# EAGLE design carteProtoV2 (EAGLE 6.1)
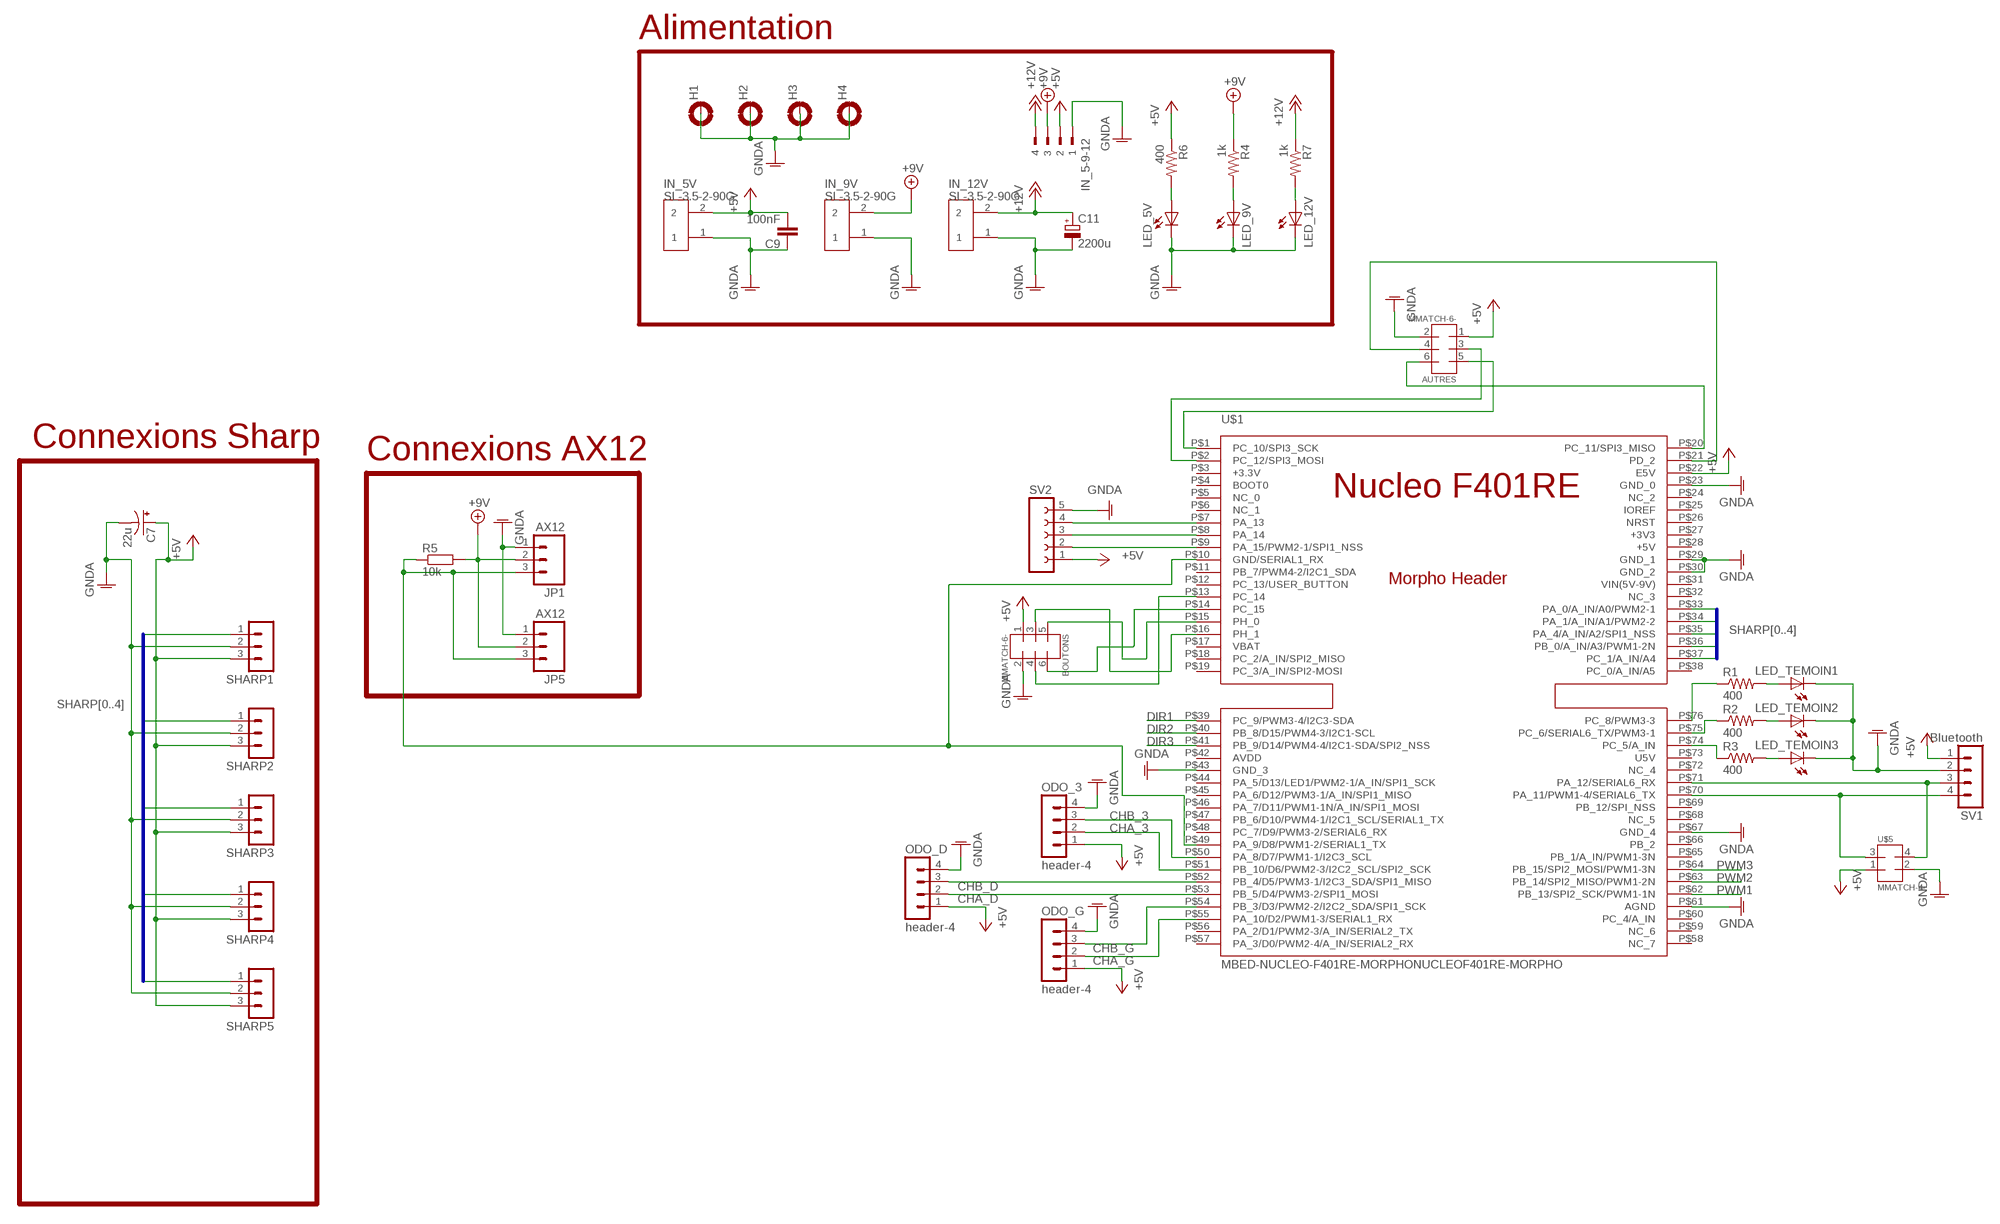
[diagram p0: schematic, sheet 1, part 1 of 2]
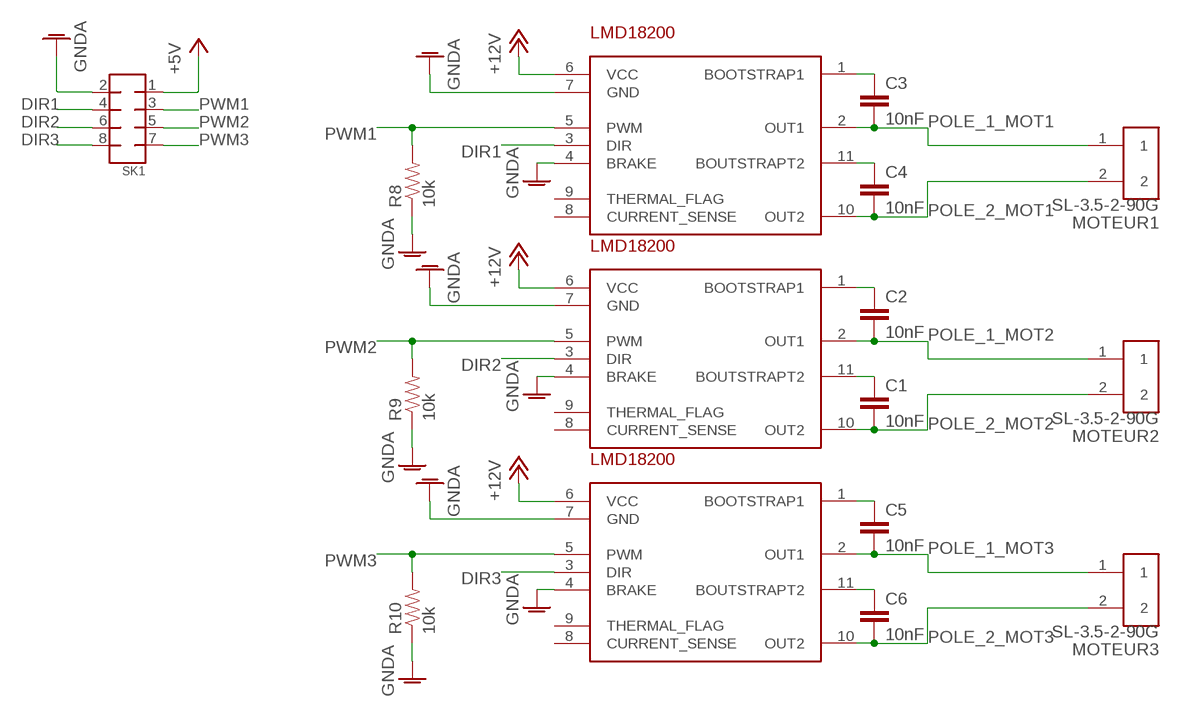
[diagram p1: schematic, sheet 1, part 2 of 2]

## Parts
AUTRES  MMATCH-6-  [AMP-215079-6]
BOUTONS  MMATCH-6-  [AMP-215079-6]
C1  10nF  C-EUC0805  [C0805]
C2  10nF  C-EUC0805  [C0805]
C3  10nF  C-EUC0805  [C0805]
C4  10nF  C-EUC0805  [C0805]
C5  10nF  C-EUC0805  [C0805]
C6  10nF  C-EUC0805  [C0805]
C7  22u  CAP_POLPTH1  [CPOL-RADIAL-100UF-25V]
C9  100nF  C-EUC0805  [C0805]
C11  2200u  CPOL-EUTT5D11  [TT5D11]
H1  MOUNT-PAD-ROUND3.2  [3,2-PAD]
H2  MOUNT-PAD-ROUND3.2  [3,2-PAD]
H3  MOUNT-PAD-ROUND3.2  [3,2-PAD]
H4  MOUNT-PAD-ROUND3.2  [3,2-PAD]
IN_5-9-12  90G-4  [90G-4]
IN_5V  SL-3.5-2-90G  [SL-3.5-2-90G]
IN_9V  SL-3.5-2-90G  [SL-3.5-2-90G]
IN_12V  SL-3.5-2-90G  [SL-3.5-2-90G]
JP1  AX12  M03POLAR  [MOLEX-1X3]
JP5  AX12  M03POLAR  [MOLEX-1X3]
LED_5V  LEDCHIPLED_0805  [CHIPLED_0805]
LED_9V  LEDCHIPLED_0805  [CHIPLED_0805]
LED_12V  LEDCHIPLED_0805  [CHIPLED_0805]
LED_TEMOIN1  LEDCHIPLED_0805  [CHIPLED_0805]
LED_TEMOIN2  LEDCHIPLED_0805  [CHIPLED_0805]
LED_TEMOIN3  LEDCHIPLED_0805  [CHIPLED_0805]
MOTEUR1  SL-3.5-2-90G  [SL-3.5-2-90G]
MOTEUR2  SL-3.5-2-90G  [SL-3.5-2-90G]
MOTEUR3  SL-3.5-2-90G  [SL-3.5-2-90G]
ODO_3  header-4  MA04-1  [MA04-1]
ODO_D  header-4  MA04-1  [MA04-1]
ODO_G  header-4  MA04-1  [MA04-1]
R1  400  RESISTOR0805-RES  [0805]
R2  400  RESISTOR0805-RES  [0805]
R3  400  RESISTOR0805-RES  [0805]
R4  1k  RESISTOR0805-RES  [0805]
R5  10k  R-EU_M0805  [M0805]
R6  400  RESISTOR0805-RES  [0805]
R7  1k  RESISTOR0805-RES  [0805]
R8  10k  RESISTOR0805-RES  [0805]
R9  10k  RESISTOR0805-RES  [0805]
R10  10k  RESISTOR0805-RES  [0805]
SHARP1  MA03-1  [MA03-1]
SHARP2  MA03-1  [MA03-1]
SHARP3  MA03-1  [MA03-1]
SHARP4  MA03-1  [MA03-1]
SHARP5  MA03-1  [MA03-1]
SK1  MMATCH-8-PTH  [AMP-215079-8]
SV1  Bluetooth  MA04-1  [MA04-1]
SV2  FE05-1  [FE05-1]
U$1  MBED-NUCLEO-F401RE-MORPHONUCLEOF401RE-MORPHO  [MORPHO-HEADERS]
U$2  LMD18200  [LMD18200]
U$3  LMD18200  [LMD18200]
U$4  LMD18200  [LMD18200]
U$5  MMATCH-4-  [AMP-215079-4]

## Nets
+5V: AUTRES.1 BOUTONS.1 C7.1(+) C9.2 IN_5-9-12.2 IN_5V.2 ODO_3.1 ODO_D.1 ODO_G.1 R6.1 SHARP1.3 SHARP2.3 SHARP3.3 SHARP4.3 SHARP5.3 SK1.1 SV1.1 SV2.1 U$1.P$22(E5V) U$5.1
+9V: IN_5-9-12.3 IN_9V.2 JP1.2 JP5.2 R4.1 R5.2
+12V: C11.+ IN_5-9-12.4 IN_12V.2 R7.1 U$2.6(VCC) U$3.6(VCC) U$4.6(VCC)
CHA_3: ODO_3.2 U$1.P$51(PB_10/D6/PWM2-3/I2C2_SCL/SPI2_SCK)
CHA_D: ODO_D.2 U$1.P$53(PB_5/D4/PWM3-2/SPI1_MOSI)
CHA_G: ODO_G.2 U$1.P$55(PA_10/D2/PWM1-3/SERIAL1_RX)
CHB_3: ODO_3.3 U$1.P$50(PA_8/D7/PWM1-1/I2C3_SCL)
CHB_D: ODO_D.3 U$1.P$52(PB_4/D5/PWM3-1/I2C3_SDA/SPI1_MISO)
CHB_G: ODO_G.3 U$1.P$54(PB_3/D3/PWM2-2/I2C2_SDA/SPI1_SCK)
DIR1: SK1.4 U$1.P$39(PC_9/PWM3-4/I2C3-SDA) U$2.3(DIR)
DIR2: SK1.6 U$1.P$40(PB_8/D15/PWM4-3/I2C1-SCL) U$3.3(DIR)
DIR3: SK1.8 U$1.P$41(PB_9/D14/PWM4-4/I2C1-SDA/SPI2_NSS) U$4.3(DIR)
GNDA: AUTRES.2 BOUTONS.2 C7.2(-) C9.1 C11.- H1.B3,2(MOUNT) H2.B3,2(MOUNT) H3.B3,2(MOUNT) H4.B3,2(MOUNT) IN_5-9-12.1 IN_5V.1 IN_9V.1 IN_12V.1 JP1.1 JP5.1 LED_5V.C LED_9V.C LED_12V.C LED_TEMOIN1.C LED_TEMOIN2.C LED_TEMOIN3.C ODO_3.4 ODO_D.4 ODO_G.4 R8.1 R9.1 R10.1 SHARP1.2 SHARP2.2 SHARP3.2 SHARP4.2 SHARP5.2 SK1.2 SV1.2 SV2.5 U$1.P$23(GND_0) U$1.P$29(GND_1) U$1.P$30(GND_2) U$1.P$43(GND_3) U$1.P$61(AGND) U$1.P$67(GND_4) U$2.4(BRAKE) U$2.7(GND) U$3.4(BRAKE) U$3.7(GND) U$4.4(BRAKE) U$4.7(GND) U$5.2
N$1: C1.1 U$3.11(BOUTSTRAPT2)
N$2: C5.1 U$4.1(BOOTSTRAP1)
N$3: C2.1 U$3.1(BOOTSTRAP1)
N$4: C6.1 U$4.11(BOUTSTRAPT2)
N$5: C3.1 U$2.1(BOOTSTRAP1)
N$6: SV1.3 U$1.P$71(PA_12/SERIAL6_RX) U$5.4
N$7: C4.1 U$2.11(BOUTSTRAPT2)
N$8: SV1.4 U$1.P$70(PA_11/PWM1-4/SERIAL6_TX) U$5.3
N$9: LED_5V.A R6.2
N$10: LED_TEMOIN3.A R3.2
N$11: LED_12V.A R7.2
N$12: R1.1 U$1.P$76(PC_8/PWM3-3)
N$13: R2.1 U$1.P$75(PC_6/SERIAL6_TX/PWM3-1)
N$14: R3.1 U$1.P$74(PC_5/A_IN)
N$15: LED_TEMOIN1.A R1.2
N$16: LED_TEMOIN2.A R2.2
N$17: BOUTONS.3 U$1.P$16(PH_1)
N$18: BOUTONS.5 U$1.P$15(PH_0)
N$19: BOUTONS.6 U$1.P$14(PC_15)
N$20: BOUTONS.4 U$1.P$13(PC_14)
N$21: SV2.4 U$1.P$7(PA_13)
N$22: SV2.3 U$1.P$8(PA_14)
N$23: SV2.2 U$1.P$9(PA_15/PWM2-1/SPI1_NSS)
N$24: AUTRES.3 U$1.P$2(PC_12/SPI3_MOSI)
N$25: LED_9V.A R4.2
N$26: AUTRES.5 U$1.P$1(PC_10/SPI3_SCK)
N$27: AUTRES.4 U$1.P$21(PD_2)
N$28: AUTRES.6 U$1.P$20(PC_11/SPI3_MISO)
POLE_1_MOT1: C3.2 MOTEUR1.1 U$2.2(OUT1)
POLE_1_MOT2: C2.2 MOTEUR2.1 U$3.2(OUT1)
POLE_1_MOT3: C5.2 MOTEUR3.1 U$4.2(OUT1)
POLE_2_MOT1: C4.2 MOTEUR1.2 U$2.10(OUT2)
POLE_2_MOT2: C1.2 MOTEUR2.2 U$3.10(OUT2)
POLE_2_MOT3: C6.2 MOTEUR3.2 U$4.10(OUT2)
PWM1: R8.2 SK1.3 U$1.P$62(PB_13/SPI2_SCK/PWM1-1N) U$2.5(PWM)
PWM2: R9.2 SK1.5 U$1.P$63(PB_14/SPI2_MISO/PWM1-2N) U$3.5(PWM)
PWM3: R10.2 SK1.7 U$1.P$64(PB_15/SPI2_MOSI/PWM1-3N) U$4.5(PWM)
SERIAL1: JP1.3 JP5.3 R5.1 U$1.P$10(GND/SERIAL1_RX) U$1.P$49(PA_9/D8/PWM1-2/SERIAL1_TX)
SHARP0: SHARP1.1 U$1.P$33(PA_0/A_IN/A0/PWM2-1)
SHARP1: SHARP2.1 U$1.P$34(PA_1/A_IN/A1/PWM2-2)
SHARP2: SHARP3.1 U$1.P$35(PA_4/A_IN/A2/SPI1_NSS)
SHARP3: SHARP4.1 U$1.P$36(PB_0/A_IN/A3/PWM1-2N)
SHARP4: SHARP5.1 U$1.P$37(PC_1/A_IN/A4)
Unconnected: U$1.P$3(+3.3V) U$1.P$4(BOOT0) U$1.P$5(NC_0) U$1.P$6(NC_1) U$1.P$11(PB_7/PWM4-2/I2C1_SDA) U$1.P$12(PC_13/USER_BUTTON) U$1.P$17(VBAT) U$1.P$18(PC_2/A_IN/SPI2_MISO) U$1.P$19(PC_3/A_IN/SPI2-MOSI) U$1.P$24(NC_2) U$1.P$25(IOREF) U$1.P$26(NRST) U$1.P$27(+3V3) U$1.P$28(+5V) U$1.P$31(VIN(5V-9V)) U$1.P$32(NC_3) U$1.P$38(PC_0/A_IN/A5) U$1.P$42(AVDD) U$1.P$44(PA_5/D13/LED1/PWM2-1/A_IN/SPI1_SCK) U$1.P$45(PA_6/D12/PWM3-1/A_IN/SPI1_MISO) U$1.P$46(PA_7/D11/PWM1-1N/A_IN/SPI1_MOSI) U$1.P$47(PB_6/D10/PWM4-1/I2C1_SCL/SERIAL1_TX) U$1.P$48(PC_7/D9/PWM3-2/SERIAL6_RX) U$1.P$56(PA_2/D1/PWM2-3/A_IN/SERIAL2_TX) U$1.P$57(PA_3/D0/PWM2-4/A_IN/SERIAL2_RX) U$1.P$58(NC_7) U$1.P$59(NC_6) U$1.P$60(PC_4/A_IN) U$1.P$65(PB_1/A_IN/PWM1-3N) U$1.P$66(PB_2) U$1.P$68(NC_5) U$1.P$69(PB_12/SPI_NSS) U$1.P$72(NC_4) U$1.P$73(U5V) U$2.8(CURRENT_SENSE) U$2.9(THERMAL_FLAG) U$3.8(CURRENT_SENSE) U$3.9(THERMAL_FLAG) U$4.8(CURRENT_SENSE) U$4.9(THERMAL_FLAG)

## Buses
SHARP[0..4]

## Notes on the sheet
- Alimentation
- Connexions Sharp
- Connexions AX12

## Library data of the parts
AUTRES BOUTONS = jt-con-micromatch:MMATCH-6-*
C1-C6 C9 = rcl:C-EU: CAPACITOR, European symbol
C7 = SparkFun-Capacitors:CAP_POL: Capacitor Polarized These are standard SMD and PTH capacitors. Normally 10uF, 47uF, and 100uF in electrolytic and tantalum varieties. Always verify the external diameter of the through hole cap, it varies with capacity, voltage, and manufacturer. The EIA devices should be standard.
C11 = rcl:CPOL-EU: POLARIZED CAPACITOR, European symbol
H1-H4 = holes:MOUNT-PAD-ROUND: MOUNTING PAD, round
IN_5-9-12 = con-weidmueller-sl35:90G-4: WEIDMUELLER CLAMP CONNECTOR; OC_FARNELL: unknown; OC_NEWARK: unknown
IN_5V IN_9V IN_12V MOTEUR1-MOTEUR3 = WEIDMULLER:SL-3.5-2-90G
JP1 JP5 = SparkFun-Connectors:M03: Header 3 Standard 3-pin 0.1" header. Use with straight break away headers (SKU : PRT-00116), right angle break away headers (PRT-00553), swiss pins (PRT-00743), machine pins (PRT-00117), and female headers (PRT-00115). Molex polarized connector foot print use with SKU : PRT-08232 with associated crimp pins and housings.
LED_5V LED_9V LED_12V LED_TEMOIN1-LED_TEMOIN3 = adafruit:LED: LED OSRAM: - CHIPLED LG R971, LG N971, LY N971, LG Q971, LY Q971, LO R971, LY R971 LH N974, LH R974 LS Q976, LO Q976, LY Q976 LO Q996 - Hyper CHIPLED LW Q18S LB Q993, LB Q99A, LB R99A - SideLED LS A670, LO A670, LY A670, LG A670, LP A670 LB A673, LV A673, LT A673, LW A673 LH A674 LY A675 LS A676, LA A676, LO A676, LY A676, LW A676 LS A679, LY A679, LG A679 - Hyper Micro SIDELED® LS Y876, LA Y876, LO Y876, LY Y876 LT Y87S - SmartLED LW L88C, LW L88S LB L89C, LB L89S, LG L890 LS L89K, LO L89K, LY L89K LS L896, LA L896, LO L896, LY L896 - TOPLED LS T670, LO T670, LY T670, LG T670, LP T670 LSG T670, LSP T670, LSY T670, LOP T670, LYG T670 LG T671, LOG T671, LSG T671 LB T673, LV T673, LT T673, LW T673 LH T674 LS T676, LA T676, LO T676, LY T676, LB T676, LH T676, LSB T676, LW T676 LB T67C, LV T67C, LT T67C, LS T67K, LO T67K, LY T67K, LW E67C LS E67B, LA E67B, LO E67B, LY E67B, LB E67C, LV E67C, LT E67C LW T67C LS T679, LY T679, LG T679 LS T770, LO T770, LY T770, LG T770, LP T770 LB T773, LV T773, LT T773, LW T773 LH T774 LS E675, LA E675, LY E675, LS T675 LS T776, LA T776, LO T776, LY T776, LB T776 LHGB T686 LT T68C, LB T68C - Hyper Mini TOPLED® LB M676 - Mini TOPLED Santana® LG M470 LS M47K, LO M47K, LY M47K Source: http://www.osram.convergy.de/
ODO_3 ODO_D ODO_G SV1 = con-lstb:MA04-1: PIN HEADER; OC_FARNELL: unknown; OC_NEWARK: unknown
R1-R4 R6-R10 = SparkFun-Passives:RESISTOR: Resistor Basic schematic elements and footprints for 0603, 1206, and PTH resistors.; OC_FARNELL: unknown
R5 = rcl:R-EU_: RESISTOR, European symbol
SHARP1-SHARP5 = con-lstb:MA03-1: PIN HEADER; OC_FARNELL: unknown; OC_NEWARK: unknown
SK1 = jt-con-micromatch:MMATCH-8-*: AMP Micromatch 8-pin
SV2 = con-lsta:FE05-1: FEMALE HEADER; OC_FARNELL: unknown; OC_NEWARK: unknown
U$1 = mbed-nucleo:MBED-NUCLEO-F401RE-MORPHO
U$2-U$4 = texas:LMD18200
U$5 = jt-con-micromatch:MMATCH-4-*

## Board
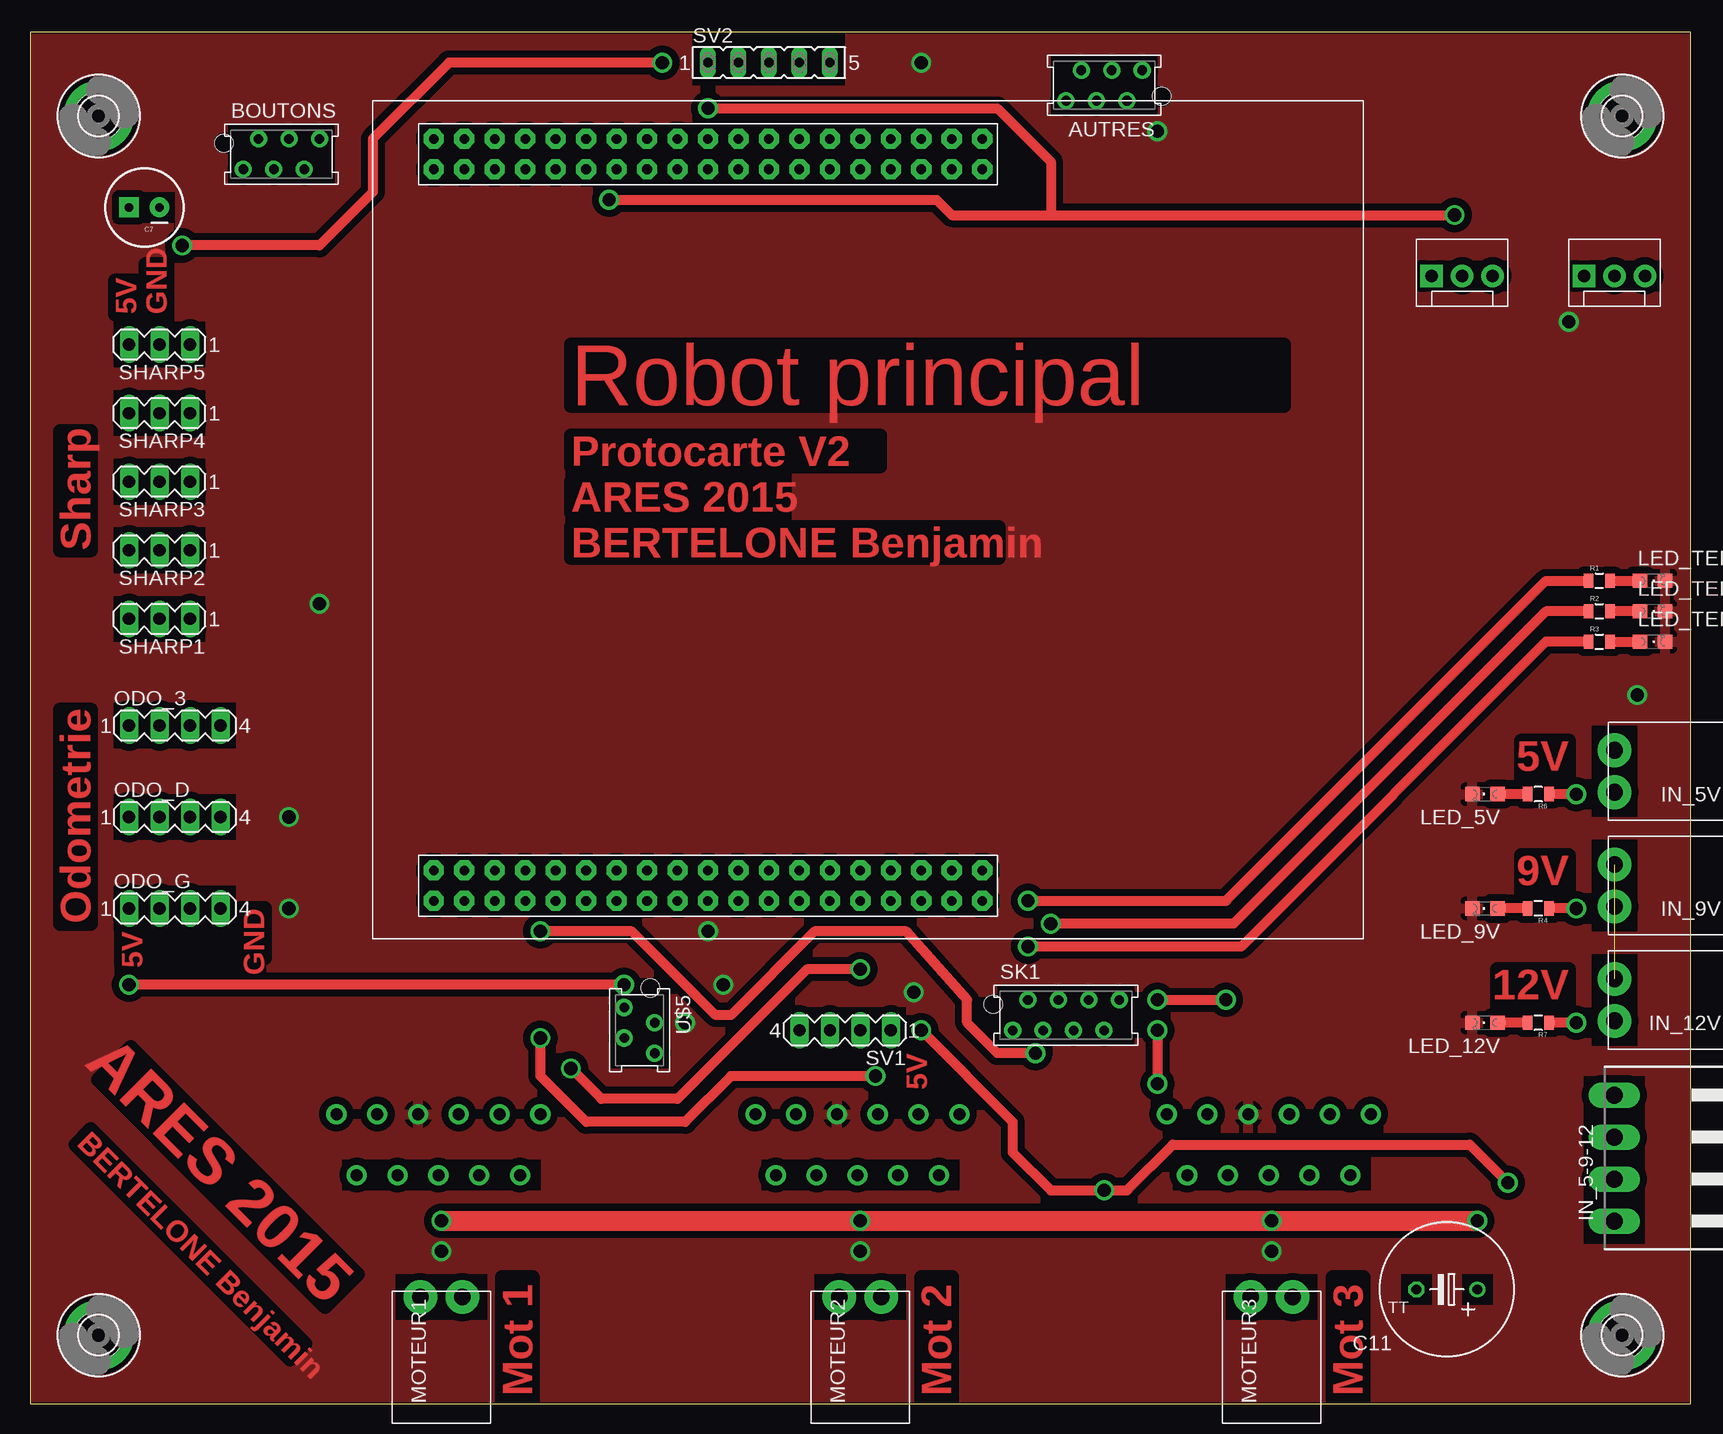
[diagram p2: board, top side]
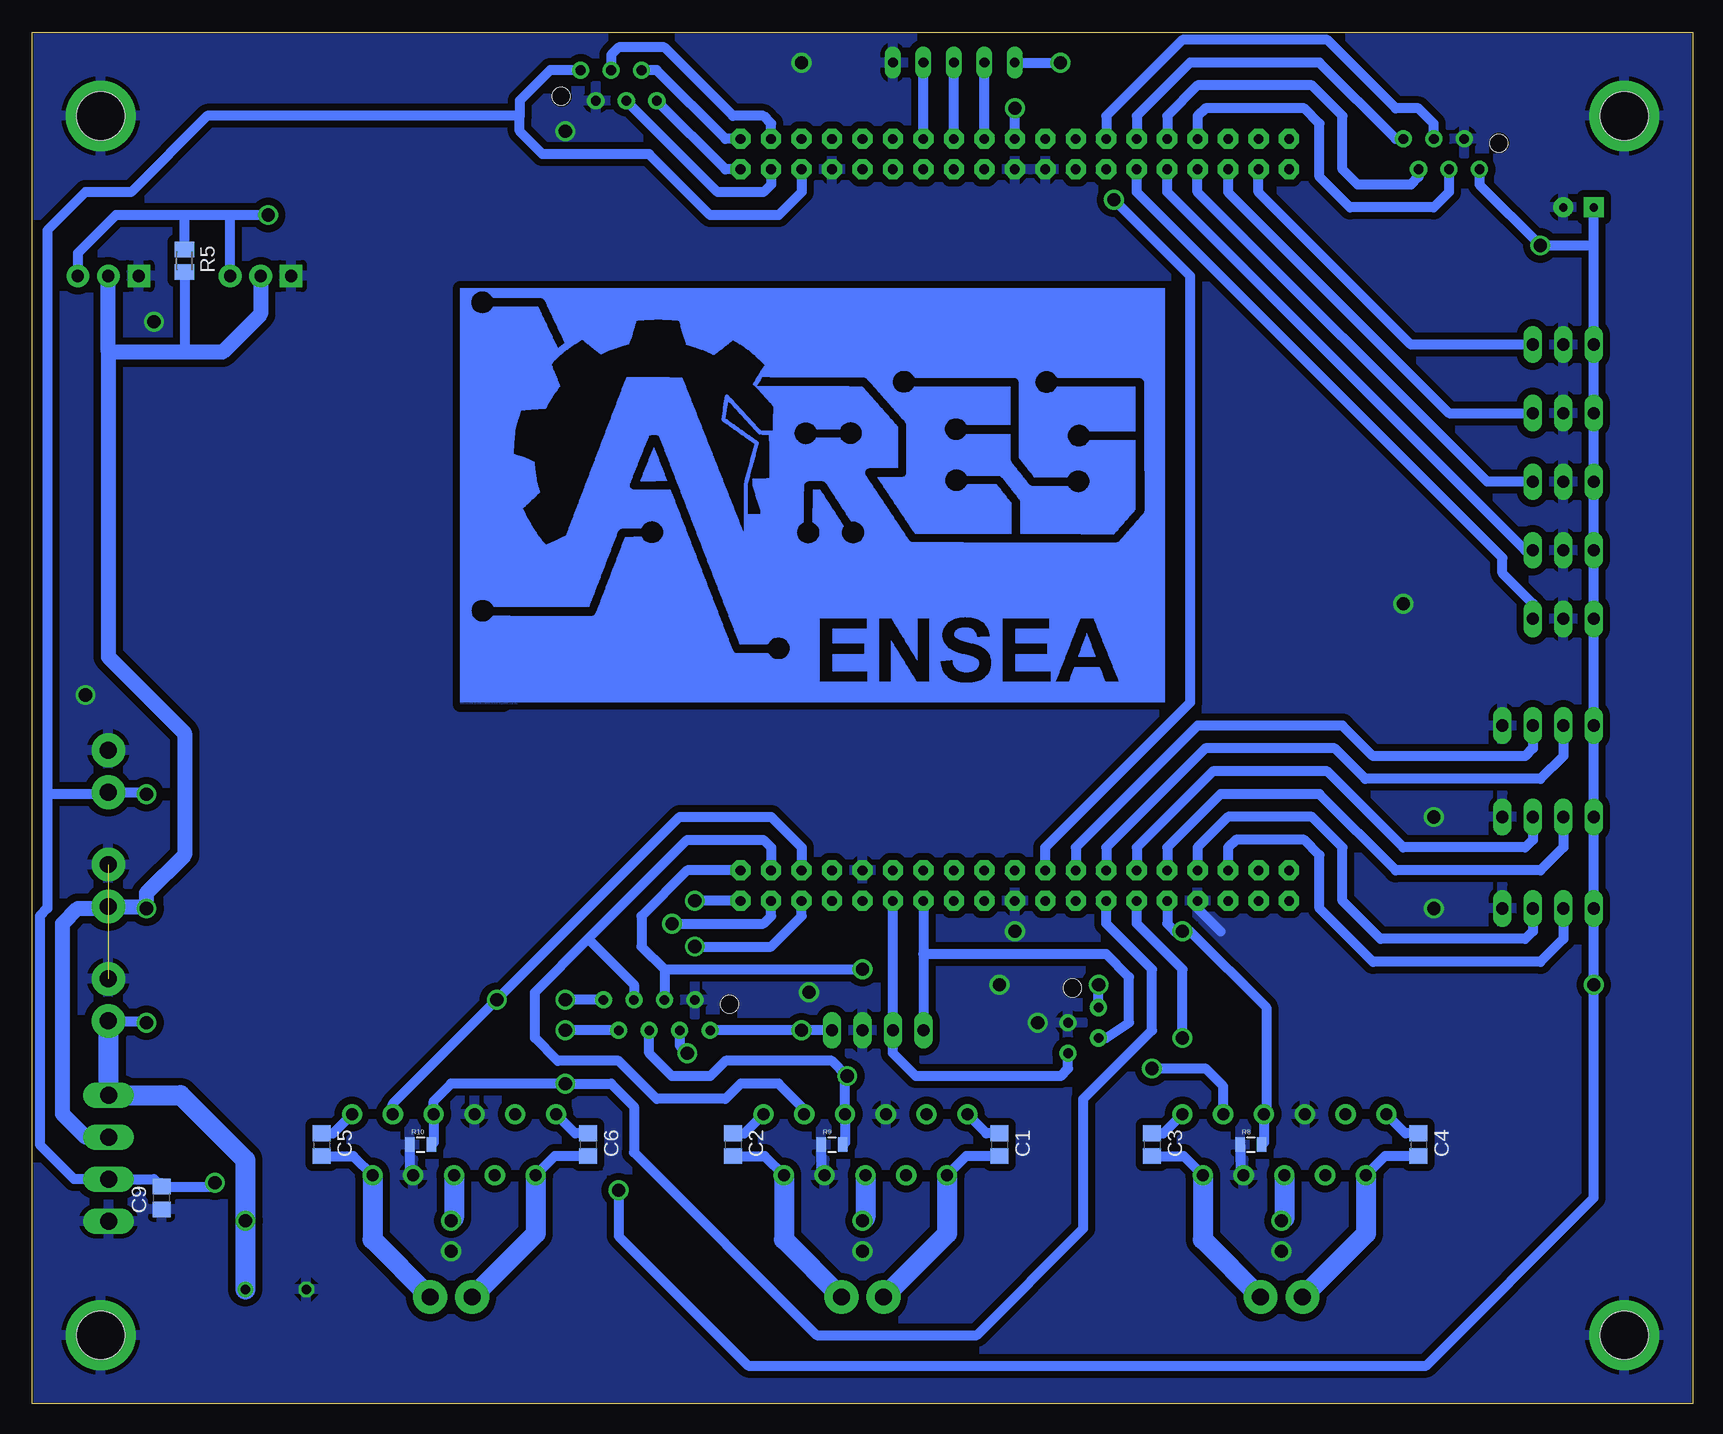
[diagram p3: board, bottom side, seen from below]

Size 138.43 x 114.3 mm. Coordinates in mm from the lower left corner, seen from the top.
Outline: 0,0 138.43,0 138.43,114.3 0,114.3 0,0
Copper layers (1*16): Top 0.035mm / dielectric 1.5mm / Bottom 0.035mm
Design rules: minimum track width 0.6mm, minimum drill 0.6mm, track to track 0.6mm, track to pad 0.6mm, pad to pad 0.6mm, via to via 0.6mm, smd to smd 0.6mm, copper to edge 4mil, drill to drill 1mm, minimum pad ring 10mil, minimum via ring 8mil, stop-mask expansion 4mil, vias tented up to drill 0mil, thermal gap 15mil
Holes 4 mm at 5.71,107.31 5.71,5.71 132.72,5.71 132.72,107.31
tRestrict: area 30.5,7 to 38.1,10.8; area 65.4,7 to 73,10.8; area 99.7,7 to 107.3,10.8; area 95.2,17.8 to 111.8,20.3; area 61,17.8 to 77.5,20.3; area 26,17.8 to 42.5,20.3; area 7,39.4 to 17.1,43.2; area 7,47 to 17.1,50.8; area 7,54.6 to 17.1,58.4; area 7,63.5 to 14.6,67.3; area 7,69.2 to 14.6,73; area 7,74.9 to 14.6,78.7; 19 more areas
bRestrict: area 60,60.1 to 61.1,60.1; area 59.8,60.1 to 61.3,60.2; area 68.8,60.2 to 72.8,60.2; area 66.8,60.2 to 67.8,60.2; area 63.6,60.2 to 64.7,60.2; area 59.6,60.2 to 61.5,60.2; area 53.5,60.2 to 57.5,60.2; area 52,60.2 to 53.1,60.2; area 47.8,60.2 to 49,60.2; area 68.8,60.2 to 72.8,60.2; area 66.8,60.2 to 67.8,60.2; area 63.6,60.2 to 64.7,60.2; 4780 more areas

### Footprints (pad centres in the part's own frame; a part is rotated, then mirrored left to right if it is on the bottom)
AMP-215079-6 = drill 0.8 pad 1.422: 1 0,0; 2 1.27,2.54; 3 2.54,0; 4 3.81,2.54; 5 5.08,0; 6 6.35,2.54 | hole 1.5: -1.62,2.175
C0805 = smd 1.3 x 1.5: 1 -0.95,0; 2 0.95,0
CPOL-RADIAL-100UF-25V = drill 0.7 pad 1.651 square: 1 1.27,0 | drill 0.7 pad 1.651: 2 -1.27,0
TT5D11 = drill 0.813: + -2.54,0 | drill 0.813 octagon: - 2.54,0
3,2-PAD = drill 3.2 pad 5.842: B3,2 0,0
90G-4 = drill 1.422 long: 1 -5.25,5.25; 2 -1.75,5.25; 3 1.75,5.25; 4 5.25,5.25
SL-3.5-2-90G = drill 1.4 pad 2.8: 1 0,-1.75; 2 0,1.75
MOLEX-1X3 = drill 1.016 pad 1.88 square: 1 0,0 | drill 1.016 pad 1.88: 2 2.54,0; 3 5.08,0
CHIPLED_0805 = smd 1.2 x 1.2: A 0,-1.05; C 0,1.05
MA04-1 = drill 1.016 long: 1 -3.81,0; 2 -1.27,0; 3 1.27,0; 4 3.81,0
0805 = smd 0.8 x 1.2: 1 -0.9,0; 2 0.9,0
M0805 = smd 1.3 x 1.6: 1 -0.95,0; 2 0.95,0
MA03-1 = drill 1.016 long: 1 -2.54,0; 2 0,0; 3 2.54,0
AMP-215079-8 = drill 0.8 pad 1.422: 1 0,-1.27; 2 1.27,1.27; 3 2.54,-1.27; 4 3.81,1.27; 5 5.08,-1.27; 6 6.35,1.27; 7 7.62,-1.27; 8 8.89,1.27 | hole 1.5: -1.62,0.905
FE05-1 = drill 0.813 long: 1 -5.08,0; 2 -2.54,0; 3 0,0; 4 2.54,0; 5 5.08,0
MORPHO-HEADERS = drill 0.8 pad 1.676 octagon: P$1 -31.75,15.875; P$2 -31.75,13.335; P$3 -31.75,10.795; P$4 -31.75,8.255; P$5 -31.75,5.715; P$6 -31.75,3.175; P$7 -31.75,0.635; P$8 -31.75,-1.905; P$9 -31.75,-4.445; P$10 -31.75,-6.985; P$11 -31.75,-9.525; P$12 -31.75,-12.065; P$13 -31.75,-14.605; P$14 -31.75,-17.145; P$15 -31.75,-19.685; P$16 -31.75,-22.225; P$17 -31.75,-24.765; P$18 -31.75,-27.305; P$19 -31.75,-29.845; P$20 -29.21,15.875; P$21 -29.21,13.335; P$22 -29.21,10.795; P$23 -29.21,8.255; P$24 -29.21,5.715; P$25 -29.21,3.175; P$26 -29.21,0.635; P$27 -29.21,-1.905; P$28 -29.21,-4.445; P$29 -29.21,-6.985; P$30 -29.21,-9.525; P$31 -29.21,-12.065; P$32 -29.21,-14.605; P$33 -29.21,-17.145; P$34 -29.21,-19.685; P$35 -29.21,-22.225; P$36 -29.21,-24.765; P$37 -29.21,-27.305; P$38 -29.21,-29.845; P$39 29.21,15.875; P$40 29.21,13.335; P$41 29.21,10.795; P$42 29.21,8.255; P$43 29.21,5.715; P$44 29.21,3.175; P$45 29.21,0.635; P$46 29.21,-1.905; P$47 29.21,-4.445; P$48 29.21,-6.985; P$49 29.21,-9.525; P$50 29.21,-12.065; P$51 29.21,-14.605; P$52 29.21,-17.145; P$53 29.21,-19.685; P$54 29.21,-22.225; P$55 29.21,-24.765; P$56 29.21,-27.305; P$57 29.21,-29.845; P$58 31.75,-29.845; P$59 31.75,-27.305; P$60 31.75,-24.765; P$61 31.75,-22.225; P$62 31.75,-19.685; P$63 31.75,-17.145; P$64 31.75,-14.605; P$65 31.75,-12.065; P$66 31.75,-9.525; P$67 31.75,-6.985; P$68 31.75,-4.445; P$69 31.75,-1.905; P$70 31.75,0.635; P$71 31.75,3.175; P$72 31.75,5.715; P$73 31.75,8.255; P$74 31.75,10.795; P$75 31.75,13.335; P$76 31.75,15.875
LMD18200 = drill 1 pad 1.676: 1 0,0; 2 1.7,5.08; 3 3.4,0; 4 5.1,5.08; 5 6.8,0; 6 8.5,5.08; 7 10.2,0; 8 11.9,5.08; 9 13.6,0; 10 15.3,5.08; 11 17,0
AMP-215079-4 = drill 0.8 pad 1.422: 1 0,0; 2 1.27,2.54; 3 2.54,0; 4 3.81,2.54 | hole 1.5: -1.62,2.175

### Placement (x,y rotation side)
AUTRES  92.71,111.12 180 top
BOUTONS  17.78,102.87 0 top
C1  57.78,21.59 270 bottom
C2  80.01,21.59 270 bottom
C3  45.08,21.59 270 bottom
C4  22.86,21.59 270 bottom
C5  114.3,21.59 270 bottom
C6  92.08,21.59 270 bottom
C7  9.53,99.7 180 top
C9  127.64,17.14 90 bottom
C11  118.11,9.53 180 top
H1  5.71,5.71 0 top
H2  5.71,107.31 0 top
H3  132.72,5.71 0 top
H4  132.72,107.31 0 top
IN_5-9-12  137.31,20.47 90 top
IN_5V  132.08,52.7 180 top
IN_9V  132.08,43.18 180 top
IN_12V  132.08,33.66 180 top
JP1  129.54,93.98 0 top
JP5  116.84,93.98 0 top
LED_5V  121.28,50.8 90 top
LED_9V  121.28,41.28 90 top
LED_12V  121.28,31.75 90 top
LED_TEMOIN1  135.25,68.58 270 top
LED_TEMOIN2  135.25,66.04 270 top
LED_TEMOIN3  135.25,63.5 270 top
MOTEUR1  34.29,8.89 90 top
MOTEUR2  69.22,8.89 90 top
MOTEUR3  103.51,8.89 90 top
ODO_3  12.06,56.52 0 top
ODO_D  12.06,48.89 0 top
ODO_G  12.06,41.28 0 top
R1  130.81,68.58 0 top
R2  130.81,66.04 0 top
R3  130.81,63.5 0 top
R4  125.73,41.28 180 top
R5  125.73,95.25 270 bottom
R6  125.73,50.8 180 top
R7  125.73,31.75 180 top
R8  36.83,21.59 0 bottom
R9  71.76,21.59 0 bottom
R10  106.05,21.59 0 bottom
SHARP1  10.79,65.41 180 top
SHARP2  10.79,71.12 180 top
SHARP3  10.79,76.84 180 top
SHARP4  10.79,82.55 180 top
SHARP5  10.79,88.27 180 top
SK1  81.92,32.39 0 top
SV1  67.94,31.11 180 top
SV2  61.59,111.76 0 top
U$1  63.5,73.66 270 top
U$2  42.55,24.13 180 top
U$3  77.47,24.13 180 top
U$4  111.76,24.13 180 top
U$5  49.53,33.02 270 top

### Tracks (layer width: path | path; a pad name or v marks a point on that pad's centre or on a via)
+5V  (via drill 1.1)
  Top 0.813: v128.91,50.8 R6.1 | v49.53,34.92 v8.25,34.92 | v74.3,31.11 81.92,23.5 81.92,20.95 85.09,17.78 v89.53,17.78 91.44,17.78 95.25,21.59 120.02,21.59 v123.19,18.41 | v52.7,111.76 34.92,111.76 28.57,105.41 28.57,100.97 24.13,96.52 v12.7,96.52
  Bottom 0.813: v128.91,50.8 129.06,50.95 IN_5V.2 | 8.25,96.52 SHARP5.3 SHARP4.3 SHARP3.3 SHARP2.3 SHARP1.3 ODO_3.1 ODO_D.1 ODO_G.1 v8.25,34.92 8.25,17.14 22.23,3.17 78.74,3.17 89.53,13.97 v89.53,17.78 | 8.25,96.52 C7.1 | BOUTONS.1 17.78,101.6 v12.7,96.52 8.89,96.52 8.25,96.52 | AUTRES.1 95.25,111.12 97.79,108.59 97.79,107.31 | U$1.P$22 74.3,100.97 76.2,99.06 81.92,99.06 87,104.14 95.89,104.14 97.79,106.05 97.79,107.31 | 97.79,107.31 123.83,107.31 130.17,100.97 133.99,100.97 137.16,97.79 137.16,50.8 | 132.23,50.8 137.16,50.8 | 137.16,50.8 137.16,41.28 137.8,40.64 137.8,21.59 134.93,18.72 IN_5-9-12.2 128.26,18.72 C9.2 127.32,18.09 | U$5.1 v49.53,34.92 | SK1.1 v74.3,31.11 SV1.1 | 127.64,18.41 127.32,18.1 127.32,18.09 | 127.32,18.09 123.51,18.09 v123.19,18.41 | SV2.1 v52.7,111.76
  Bottom 1.27: 132.23,50.8 IN_5V.2
+9V  (via drill 1.1)
  Top 0.813: v128.91,41.28 R4.1
  Bottom 0.813: 129.06,41.43 v128.91,41.28 | R5.2 125.73,87.63
  Bottom 1.27: 129.06,41.43 IN_9V.2 132.23,41.28 134.62,41.28 135.89,40 135.89,24.13 133.98,22.22 IN_5-9-12.3 | 132.08,87.63 125.73,87.63 122.56,87.63 119.38,90.81 JP5.2 | 132.08,87.63 JP1.2 | 132.08,87.63 132.08,62.23 125.73,55.88 125.73,45.72 128.91,42.55 v128.91,41.28
+12V  (via drill 1.1)
  Top 0.813: v128.91,31.75 R7.1
  Top 1.676: v120.65,15.24 v103.51,15.24 v69.22,15.24 v34.29,15.24
  Bottom 0.813: 132.06,31.89 129.04,31.89 v128.91,31.75
  Bottom 1.676: IN_12V.2 132.06,31.89 IN_5-9-12.4 126.05,25.72 120.65,20.32 v120.65,15.24 C11.+ | U$4.6 103.26,15.48 v103.51,15.24 | U$3.6 68.97,15.48 v69.22,15.24 | U$2.6 34.05,15.48 v34.29,15.24
CHA_3
  Bottom 0.813: ODO_3.2 10.79,53.97 12.7,52.07 27.3,52.07 29.84,54.61 40.64,54.61 48.89,46.36 U$1.P$51
CHA_D
  Bottom 0.813: ODO_D.2 10.79,46.36 12.7,44.45 24.77,44.45 31.11,50.8 39.37,50.8 43.81,46.36 U$1.P$53
CHA_G
  Bottom 0.813: ODO_G.2 10.79,38.73 12.7,36.83 26.67,36.83 31.11,41.28 31.11,45.72 32.39,46.99 38.1,46.99 38.73,46.36 U$1.P$55
CHB_3
  Bottom 0.813: ODO_3.3 13.34,54.61 13.97,53.97 26.67,53.97 29.21,56.52 41.28,56.52 51.44,46.36 U$1.P$50
CHB_D
  Bottom 0.813: ODO_D.3 13.34,46.99 13.97,46.36 24.13,46.36 30.48,52.7 40,52.7 46.36,46.36 U$1.P$52
CHB_G
  Bottom 0.813: ODO_G.3 13.34,39.37 13.97,38.73 26.04,38.73 29.21,41.91 29.21,46.36 31.75,48.89 38.73,48.89 41.28,46.36 U$1.P$54
DIR1  (via drill 1.1)
  Top 0.813: v45.08,27.94 47.62,25.4 53.97,25.4 64.77,36.2 v69.22,36.2
  Bottom 0.813: U$2.3 39.14,26.45 40.64,27.94 v45.08,27.94 | 85.73,36.2 SK1.4 | U$1.P$39 83.82,44.45 87.63,40.64 87.63,38.1 85.73,36.2 | 85.73,36.2 v69.22,36.2
DIR2
  Bottom 0.813: U$3.3 74.07,24.54 76.2,26.67 79.38,26.67 80.65,25.4 86.36,25.4 89.53,28.57 94.62,28.57 96.52,30.48 96.52,34.29 92.08,38.73 | SK1.6 88.27,34.92 92.08,38.73 | 92.08,38.73 83.82,46.99 77.47,46.99 76.84,46.36 U$1.P$40
DIR3  (via drill 1.1)
  Top 0.813: v93.98,33.66 v99.7,33.66
  Bottom 0.813: U$4.3 108.36,24.99 v99.7,33.66 84.45,48.89 76.84,48.89 74.3,46.36 U$1.P$41 | SK1.8 v93.98,33.66
GNDA  (via drill 1.1)  (1 unrouted)
  Bottom 0.813: R8.1 37.73,19.31 37.47,19.05 | R9.1 72.66,19.34 U$3.4 | R10.1 106.95,19.34 U$4.4 | U$1.P$61 41.28,41.28 39.37,39.37
  other vias: 34.29,12.7 69.22,12.7 103.51,12.7 54.61,31.75 93.98,106.05 21.59,48.89 21.59,41.28 57.78,34.92 56.52,39.37 73.66,34.29 128.27,90.17 24.13,66.67 133.99,59.06 74.3,111.76
  pour Bottom: 0,114.3 138.43,114.3 138.43,0 0,0
  pour Top: 0,114.3 138.43,114.3 138.43,0 0,0
N$1
  Bottom 0.813: C1.1 58.88,22.54 U$3.11
N$2
  Bottom 0.813: C5.1 113.35,22.54 U$4.1
N$3
  Bottom 0.813: C2.1 79.06,22.54 U$3.1
N$4
  Bottom 0.813: C6.1 93.17,22.54 U$4.11
N$5
  Bottom 0.813: C3.1 44.14,22.54 U$2.1
N$6
  Bottom 0.813: U$1.P$71 SV1.3 66.67,29.21 64.77,27.3 52.7,27.3 52.07,27.94 U$5.4
N$7
  Bottom 0.813: C4.1 23.95,22.54 U$2.11
N$8
  Bottom 0.813: U$1.P$70 64.14,37.47 | 64.14,37.47 SV1.4 | U$5.3 48.89,30.48 46.99,31.75 46.99,35.56 48.89,37.47 64.14,37.47
N$9
  Top 0.813: R6.2 LED_5V.A
N$10
  Top 0.813: R3.2 LED_TEMOIN3.A
N$11
  Top 0.813: R7.2 LED_12V.A
N$12  (via drill 1.1)
  Top 0.813: v83.19,41.91 99.7,41.91 126.37,68.58 R1.1
  Bottom 0.813: U$1.P$76 v83.19,41.91
N$13  (via drill 1.1)
  Top 0.813: R2.1 126.37,66.04 100.33,40 v85.09,40
  Bottom 0.813: v85.09,40 77.47,40 76.84,40.64 U$1.P$75
N$14  (via drill 1.1)
  Top 0.813: R3.1 126.37,63.5 100.97,38.1 v83.19,38.1
  Bottom 0.813: v83.19,38.1 76.84,38.1 74.3,40.64 U$1.P$74
N$15
  Top 0.813: R1.2 LED_TEMOIN1.A
N$16
  Top 0.813: LED_TEMOIN2.A R2.2
N$17
  Bottom 0.813: BOUTONS.3 20.32,100.97 21.59,99.7 28.57,99.7 31.11,102.23 31.11,106.68 32.39,107.95 40.64,107.95 41.28,107.31 U$1.P$16
N$18
  Bottom 0.813: BOUTONS.5 22.86,102.23 23.5,101.6 27.94,101.6 29.21,102.87 29.21,107.31 31.75,109.86 41.28,109.86 43.81,107.31 U$1.P$15
N$19
  Bottom 0.813: BOUTONS.6 24.77,105.41 31.11,111.76 41.91,111.76 46.36,107.31 U$1.P$14
N$20
  Bottom 0.813: BOUTONS.4 21.59,106.68 22.86,107.95 24.77,107.95 30.48,113.67 42.55,113.67 48.89,107.31 U$1.P$13
N$21
  Bottom 0.813: U$1.P$7 SV2.4
N$22
  Bottom 0.813: U$1.P$8 SV2.3
N$23
  Bottom 0.813: U$1.P$9 SV2.2
N$24
  Bottom 0.813: U$1.P$2 76.84,106.68 77.47,107.31 80.01,107.31 85.73,113.03 89.53,113.03 90.17,112.4 AUTRES.3
N$25
  Top 0.813: R4.2 LED_9V.A
N$26
  Bottom 0.813: U$1.P$1 80.65,105.41 86.36,111.12 AUTRES.5
N$27
  Bottom 0.813: U$1.P$21 76.84,101.6 77.47,100.97 81.28,100.97 AUTRES.4
N$28
  Bottom 0.813: U$1.P$20 80.65,102.87 AUTRES.6
POLE_1_MOT1
  Bottom 0.813: C3.2 42.44,20.64 U$2.2
  Bottom 1.676: U$2.2 40.84,13.7 MOTEUR1.1
POLE_1_MOT2
  Bottom 0.813: C2.2 77.36,20.64 U$3.2
  Bottom 1.676: U$3.2 75.77,13.7 MOTEUR2.1
POLE_1_MOT3
  Bottom 0.813: C5.2 111.65,20.64 U$4.2
  Bottom 1.676: U$4.2 110.06,13.7 MOTEUR3.1
POLE_2_MOT1
  Bottom 0.813: C4.2 25.66,20.64 U$2.10
  Bottom 1.676: U$2.10 27.25,14.19 MOTEUR1.2
POLE_2_MOT2
  Bottom 0.813: C1.2 60.58,20.64 U$3.10
  Bottom 1.676: U$3.10 62.17,14.19 MOTEUR2.2
POLE_2_MOT3
  Bottom 0.813: C6.2 94.87,20.64 U$4.10
  Bottom 1.676: U$4.10 96.46,14.19 MOTEUR3.2
PWM1  (via drill 1.1)
  Top 0.813: v83.82,29.21 80.65,29.21 78.11,31.75 78.11,33.66 73.03,39.37 65.41,39.37 58.42,32.39 57.15,32.39 50.17,39.37 v42.55,39.37
  Bottom 0.813: R8.2 35.75,21.77 U$2.5 35.56,24.32 35.56,33.02 41.91,39.37 v42.55,39.37 43.18,39.37 43.81,40 U$1.P$62 | SK1.3 84.45,29.84 v83.82,29.21
PWM2  (via drill 1.1)
  Top 0.813: v70.48,27.3 58.42,27.3 54.61,23.5 46.36,23.5 42.55,27.3 v42.55,30.48
  Bottom 0.813: R9.2 70.67,21.77 U$3.5 70.67,27.12 v70.48,27.3 71.76,28.57 80.65,28.57 81.92,27.3 85.09,27.3 87,29.21 SK1.5 | U$1.P$63 46.36,40 42.55,36.2 v42.55,30.48
PWM3  (via drill 1.1)
  Top 0.813: v93.98,31.11 v93.98,26.67
  Bottom 0.813: R10.2 104.96,21.77 U$4.5 104.96,25.21 103.51,26.67 v93.98,26.67 90.17,26.67 88.27,24.77 88.27,20.95 73.03,5.71 59.69,5.71 50.8,14.61 50.8,25.4 45.08,31.11 45.08,36.2 48.89,40 U$1.P$64 | SK1.7 v93.98,31.11
SERIAL1  (via drill 1.1)
  Top 0.813: v56.52,107.95 80.65,107.95 85.09,103.51 85.09,99.06 | v48.26,100.33 75.56,100.33 76.84,99.06 85.09,99.06 | 85.09,99.06 v118.75,99.06
  Bottom 0.813: U$1.P$49 53.97,46.36 41.91,58.42 41.91,93.98 v48.26,100.33 | U$1.P$10 v56.52,107.95 | 121.92,99.06 125.73,99.06 | 125.73,99.06 131.44,99.06 134.62,95.89 JP1.3 | R5.1 125.73,99.06 | JP5.3 121.92,99.06 | v118.75,99.06 121.92,99.06
SHARP0
  Bottom 0.813: SHARP1.1 13.34,66.67 15.88,69.22 15.88,70.48 46.36,100.97 U$1.P$33
SHARP1
  Bottom 0.813: SHARP2.1 13.97,71.12 43.81,100.97 U$1.P$34
SHARP2
  Bottom 0.813: SHARP3.1 17.14,76.84 41.28,100.97 U$1.P$35
SHARP3
  Bottom 0.813: U$1.P$36 38.73,100.97 20.32,82.55 SHARP4.1
SHARP4
  Bottom 0.813: SHARP5.1 23.5,88.27 36.2,100.97 U$1.P$37
(copper drawn outside any net)
  shapes: Bottom area x5698

### Text on the board
Top: 5V | GND | Robot principal | Protocarte V2 | ARES 2015 | Sharp | BERTELONE Benjamin | 5V | 9V | GND | Odometrie | 5V | 12V | 5V | BERTELONE Benjamin | ARES 2015 | Mot 1 | Mot 2 | Mot 3
Bottom: A:/Documents/Benjamin/Assoc/ARES 2014-2015/logoARES_eagle.bmp